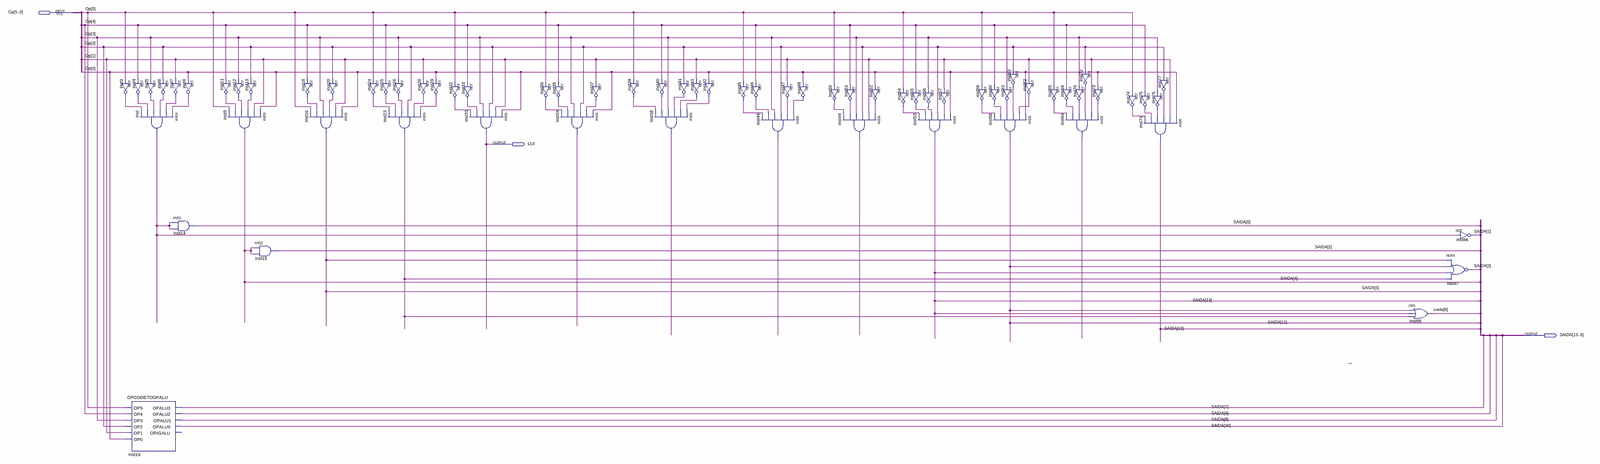
[diagram p0: schematic sheet, whole]
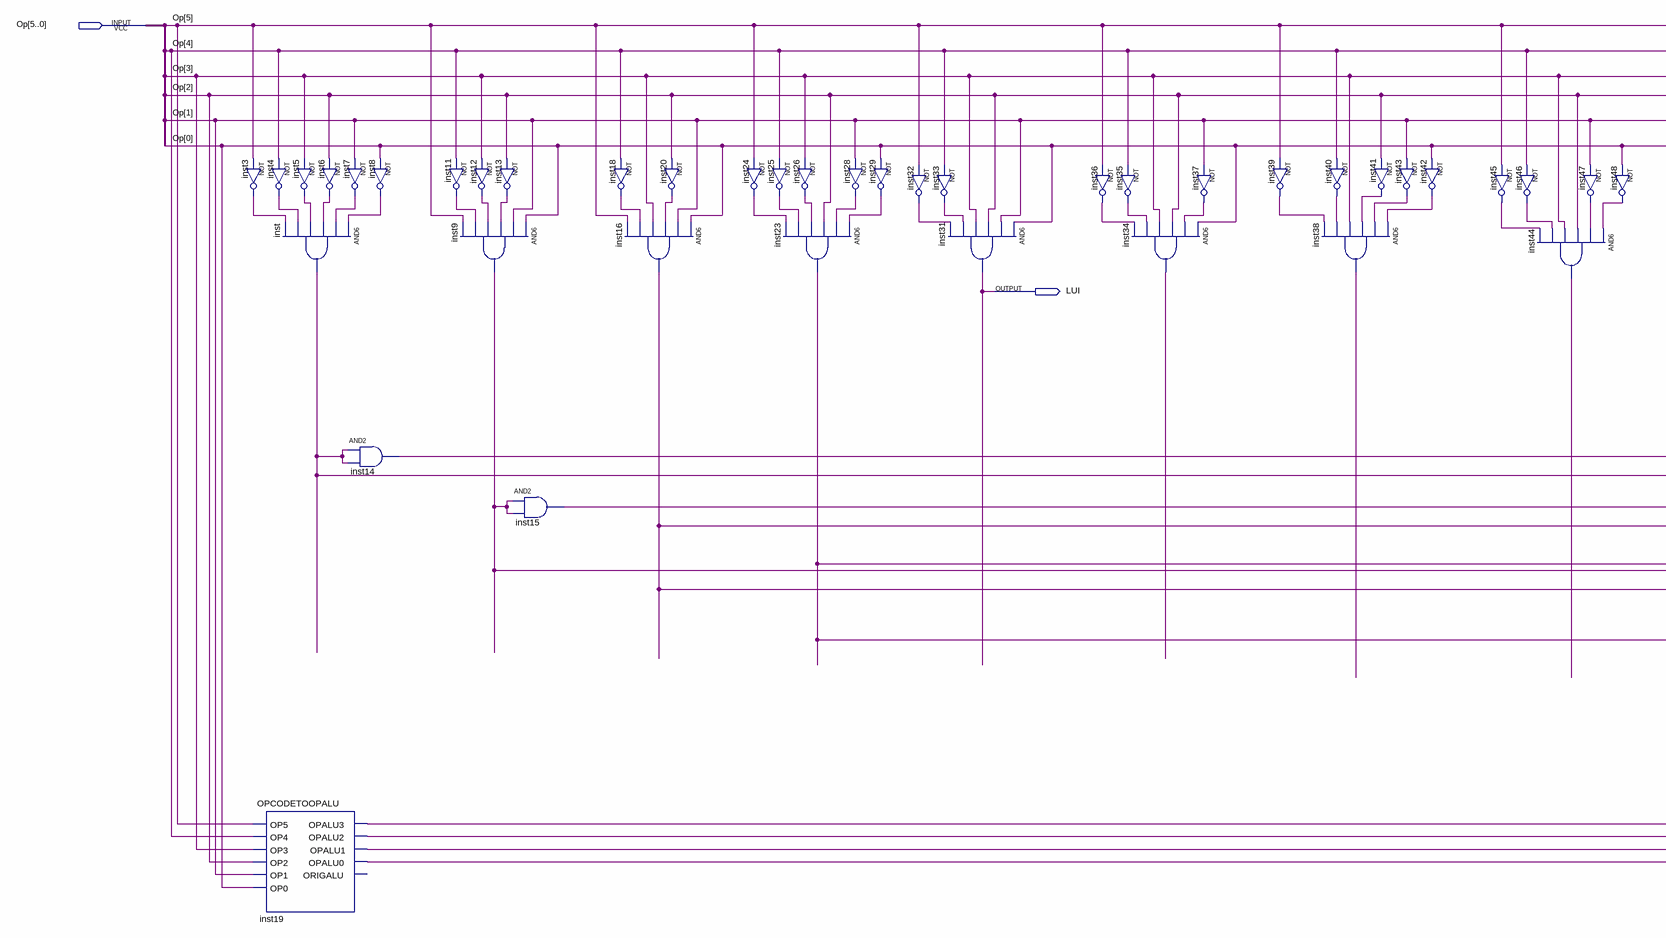
[diagram p1: schematic sheet, left part]
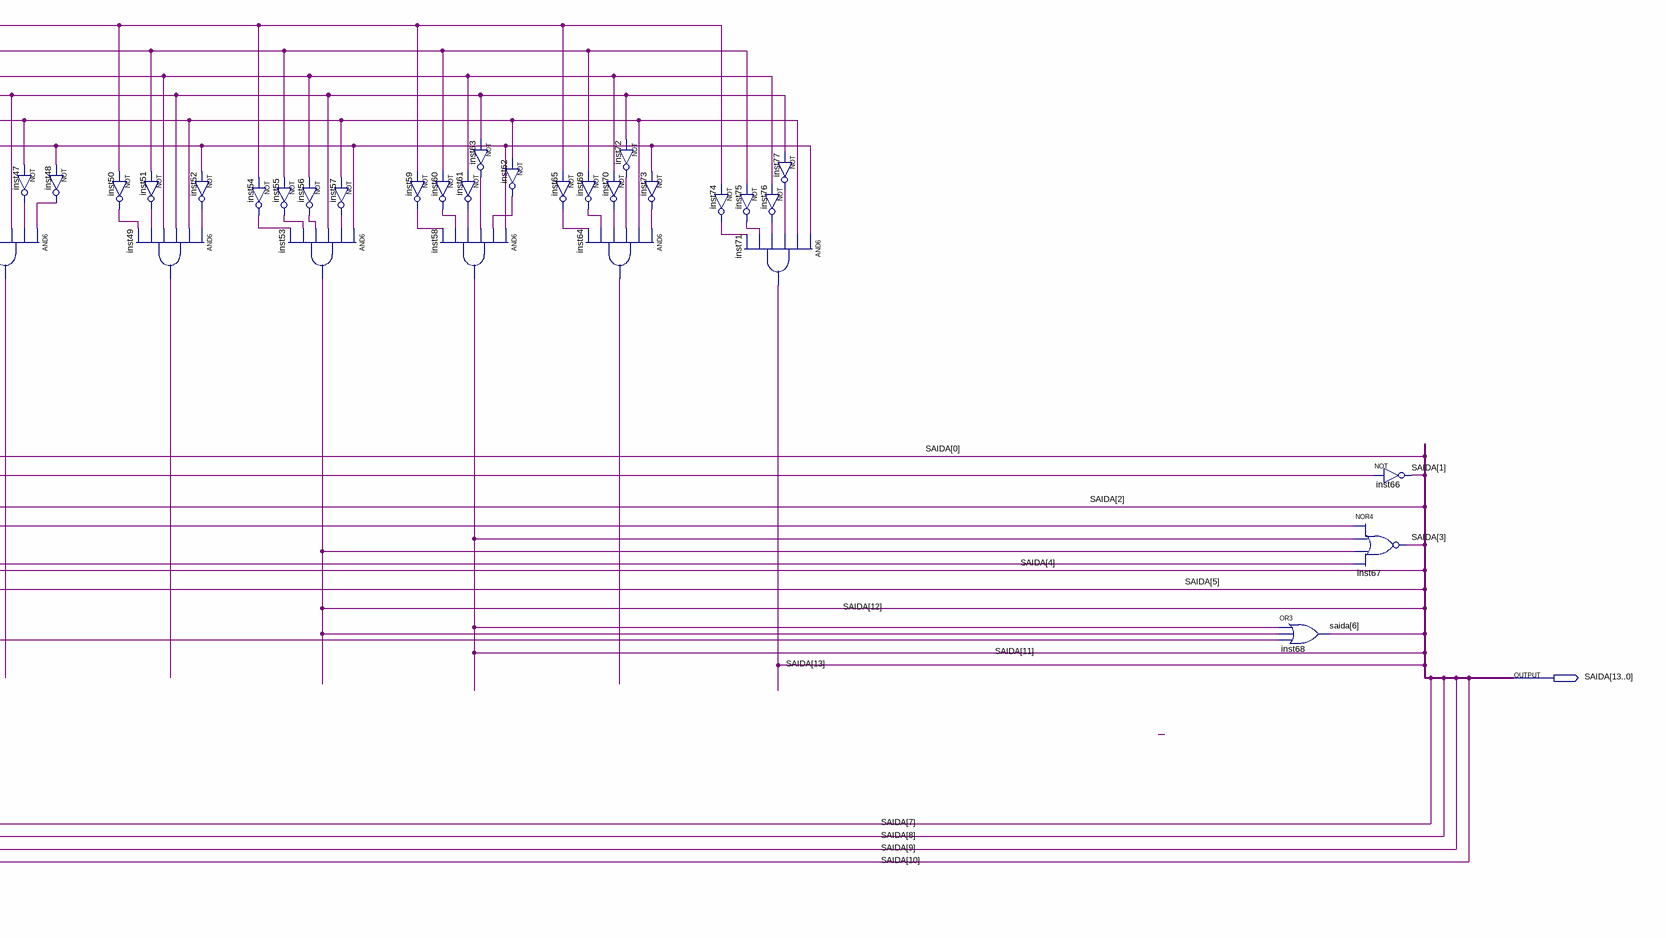
[diagram p2: schematic sheet, right part]
// Quartus schematic CONTROLE_PRINCIPAL.bdf as structural Verilog: 70 symbols, 3 pins
module CONTROLE_PRINCIPAL (
  input  [5:0] Op,
  output LUI,
  output [13:0] SAIDA
);

  wire inst3_out, inst4_out, inst5_out, inst6_out, inst7_out, inst8_out, inst11_out, inst12_out, inst13_out,
       inst18_out, inst20_out, inst23_out, inst24_out, inst25_out, inst26_out, inst28_out, inst29_out,
       inst32_out, inst33_out, inst34_out, inst35_out, inst36_out, inst37_out, inst38_out, inst39_out,
       inst40_out, inst41_out, inst42_out, inst43_out, inst44_out, inst45_out, inst46_out, inst47_out,
       inst48_out, inst49_out, inst50_out, inst51_out, inst52_out, inst54_out, inst55_out, inst56_out,
       inst57_out, inst59_out, inst60_out, inst61_out, inst62_out, inst63_out, inst64_out, inst65_out,
       inst69_out, inst70_out, inst72_out, inst73_out, inst74_out, inst75_out, inst76_out, inst77_out,
       inst_out;

  not inst3 (inst3_out, Op[5]);
  OPCODETOOPALU inst19 (
    .OP5(Op[5]), .OP4(Op[4]), .OP3(Op[3]), .OP2(Op[2]), .OP1(Op[1]), .OP0(Op[0]), .OPALU3(SAIDA[7]),
    .OPALU2(SAIDA[8]), .OPALU1(SAIDA[9]), .OPALU0(SAIDA[10]));  // open: ORIGALU
  not inst4 (inst4_out, Op[4]);
  not inst5 (inst5_out, Op[3]);
  and inst (inst_out, inst8_out, inst7_out, inst6_out, inst5_out, inst4_out, inst3_out);
  not inst6 (inst6_out, Op[2]);
  not inst7 (inst7_out, Op[1]);
  and inst14 (SAIDA[0], inst_out, inst_out);
  not inst8 (inst8_out, Op[0]);
  not inst11 (inst11_out, Op[4]);
  and inst9 (SAIDA[4], Op[0], Op[1], inst13_out, inst12_out, inst11_out, Op[5]);
  not inst12 (inst12_out, Op[3]);
  not inst13 (inst13_out, Op[2]);
  and inst15 (SAIDA[2], SAIDA[4], SAIDA[4]);
  not inst18 (inst18_out, Op[4]);
  and inst16 (SAIDA[5], Op[0], Op[1], inst20_out, Op[3], inst18_out, Op[5]);
  not inst20 (inst20_out, Op[2]);
  not inst24 (inst24_out, Op[5]);
  not inst25 (inst25_out, Op[4]);
  not inst26 (inst26_out, Op[3]);
  and inst23 (inst23_out, inst29_out, inst28_out, Op[2], inst26_out, inst25_out, inst24_out);
  not inst28 (inst28_out, Op[1]);
  not inst29 (inst29_out, Op[0]);
  not inst32 (inst32_out, Op[5]);
  not inst33 (inst33_out, Op[4]);
  and inst31 (LUI, Op[0], Op[1], Op[2], Op[3], inst33_out, inst32_out);
  not inst35 (inst35_out, Op[4]);
  not inst36 (inst36_out, Op[5]);
  and inst34 (inst34_out, Op[0], inst37_out, Op[2], Op[3], inst35_out, inst36_out);
  not inst37 (inst37_out, Op[1]);
  not inst39 (inst39_out, Op[5]);
  not inst40 (inst40_out, Op[4]);
  and inst38 (inst38_out, inst42_out, inst43_out, inst41_out, Op[3], inst40_out, inst39_out);
  not inst41 (inst41_out, Op[2]);
  not inst42 (inst42_out, Op[0]);
  not inst43 (inst43_out, Op[1]);
  not inst45 (inst45_out, Op[5]);
  not inst46 (inst46_out, Op[4]);
  and inst44 (inst44_out, inst48_out, inst47_out, Op[2], Op[3], inst46_out, inst45_out);
  not inst47 (inst47_out, Op[1]);
  not inst48 (inst48_out, Op[0]);
  not inst50 (inst50_out, Op[5]);
  not inst51 (inst51_out, Op[4]);
  and inst49 (inst49_out, inst52_out, Op[1], Op[2], Op[3], inst51_out, inst50_out);
  not inst52 (inst52_out, Op[0]);
  not inst54 (inst54_out, Op[5]);
  not inst55 (inst55_out, Op[4]);
  not inst56 (inst56_out, Op[3]);
  and inst53 (SAIDA[12], Op[0], inst57_out, Op[2], inst56_out, inst55_out, inst54_out);
  not inst57 (inst57_out, Op[1]);
  not inst59 (inst59_out, Op[5]);
  not inst63 (inst63_out, Op[2]);
  not inst60 (inst60_out, Op[4]);
  not inst61 (inst61_out, Op[3]);
  and inst58 (SAIDA[11], Op[0], inst62_out, inst63_out, inst61_out, inst60_out, inst59_out);
  not inst62 (inst62_out, Op[1]);
  not inst65 (inst65_out, Op[5]);
  not inst72 (inst72_out, Op[2]);
  not inst69 (inst69_out, Op[4]);
  not inst70 (inst70_out, Op[3]);
  and inst64 (inst64_out, inst73_out, Op[1], inst72_out, inst70_out, inst69_out, inst65_out);
  not inst73 (inst73_out, Op[0]);
  not inst74 (inst74_out, Op[5]);
  not inst77 (inst77_out, Op[2]);
  not inst75 (inst75_out, Op[4]);
  not inst76 (inst76_out, Op[3]);
  and inst71 (SAIDA[13], Op[0], Op[1], inst77_out, inst76_out, inst75_out, inst74_out);
  or inst68 (SAIDA[6], SAIDA[11], SAIDA[12], inst23_out);
  not inst66 (SAIDA[1], inst_out);
  nor inst67 (SAIDA[3], SAIDA[5], SAIDA[11], SAIDA[12], inst23_out);
endmodule
